# EAGLE design EMG_rev_I (EAGLE 7.6.0)
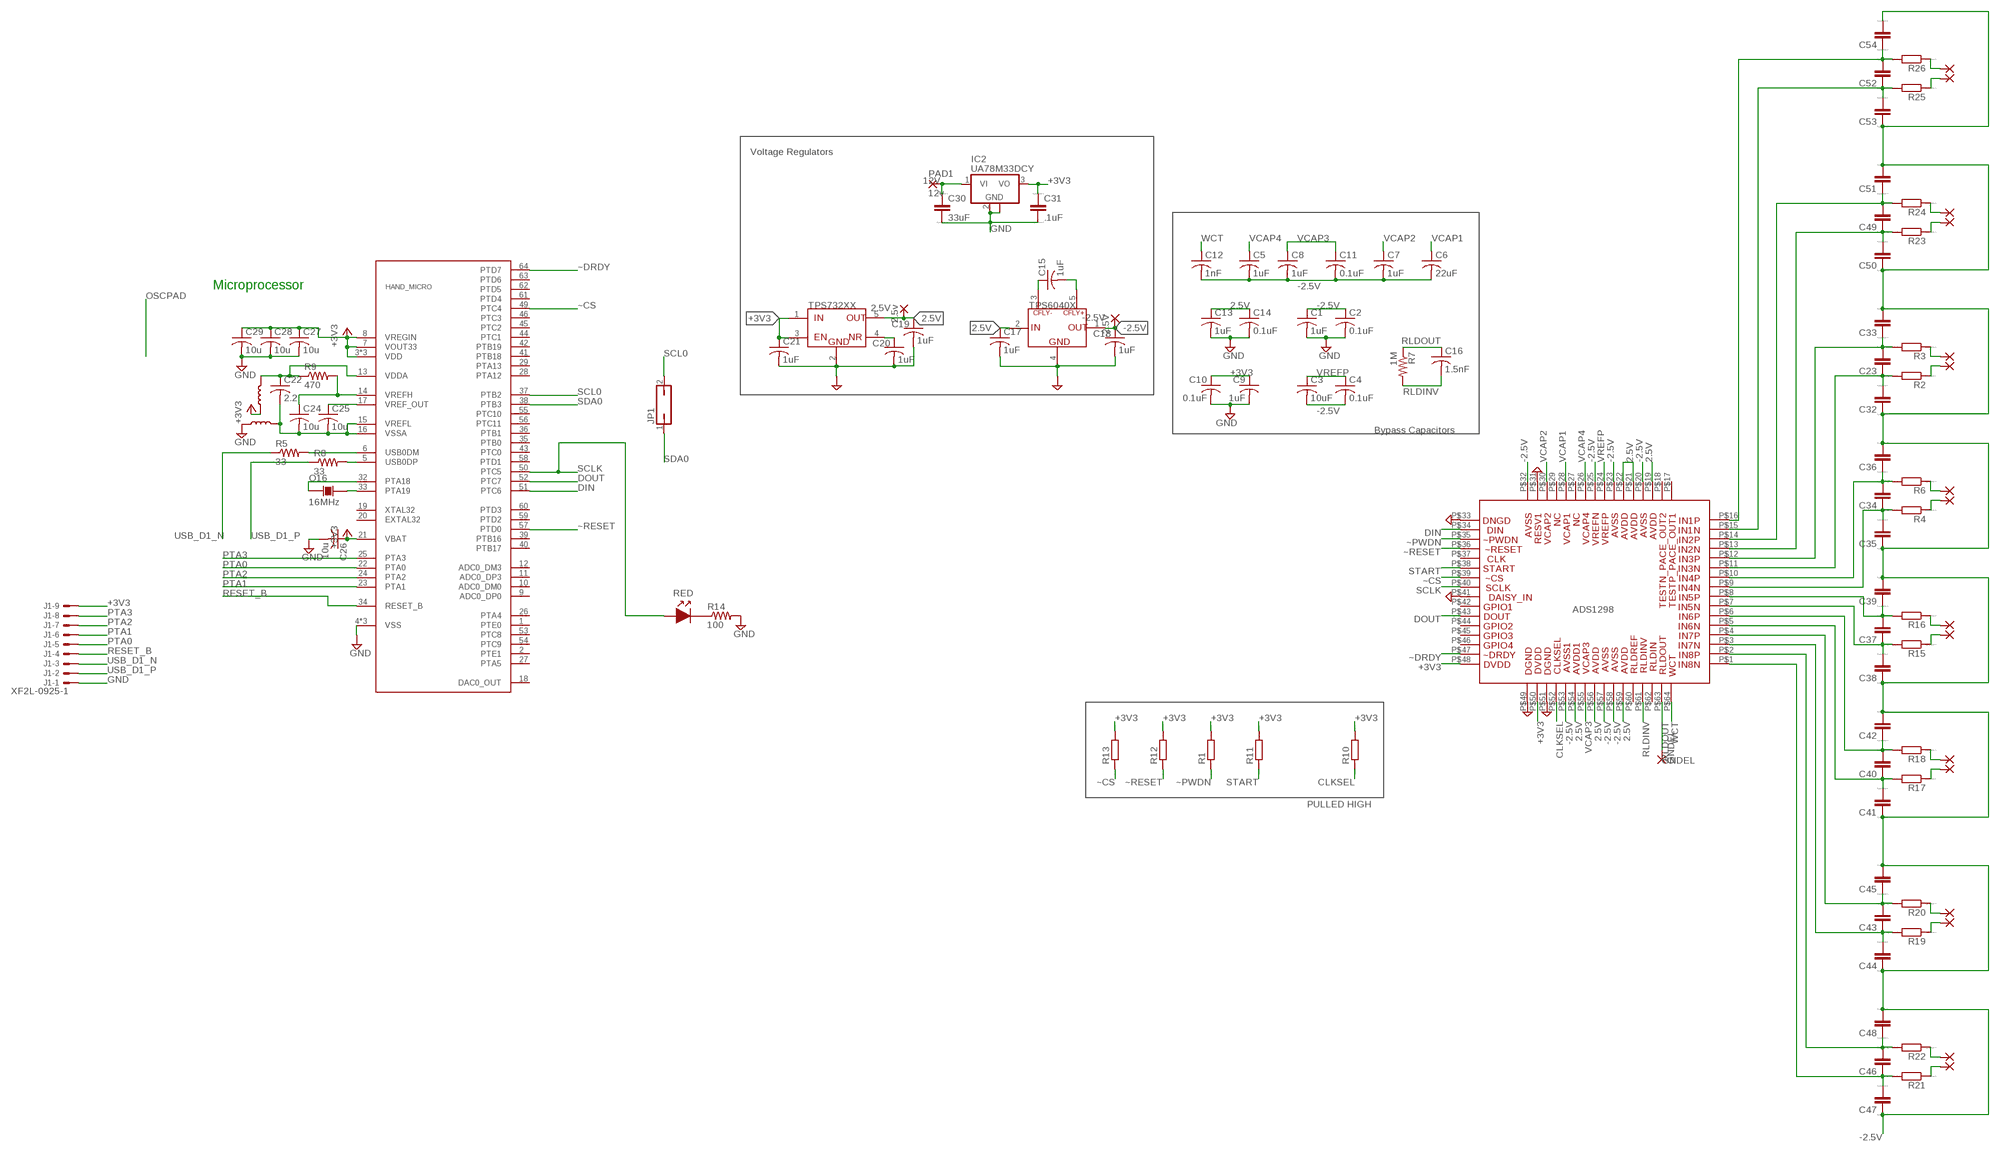
[diagram p0: schematic, sheet 1]

## Parts
2.5V  2.5v  2,54/0,9  [2,54/0,9]
-2.5V  -2.5V  2,54/0,9  [2,54/0,9]
C1  1uF  C-USC0603  [C0603]
C2  0.1uF  C-USC0603  [C0603]
C3  10uF  C-USC0603  [C0603]
C4  0.1uF  C-USC0603  [C0603]
C5  1uF  C-USC0603  [C0603]
C6  22uF  C-USC0603  [C0603]
C7  1uF  C-USC0603  [C0603]
C8  1uF  C-USC0603  [C0603]
C9  1uF  C-USC0603  [C0603]
C10  0.1uF  C-USC0603  [C0603]
C11  0.1uF  C-USC0603  [C0603]
C12  1nF  C-USC0603  [C0603]
C13  1uF  C-USC0603  [C0603]
C14  0.1uF  C-USC0603  [C0603]
C15  1uF  C-USC0603  [C0603]
C16  1.5nF  C-USC0603  [C0603]
C17  1uF  C-USC0603  [C0603]
C18  1uF  C-USC0603  [C0603]
C19  1uF  C-USC0603  [C0603]
C20  1uF  C-USC0603  [C0603]
C21  1uF  C-USC0603  [C0603]
C22  2.2  C-USC0402  [C0402]
C23  CC0402  [C0402]
C24  10u  C-USC0402  [C0402]
C25  10u  C-USC0402  [C0402]
C26  10u  C-USC0402  [C0402]
C27  10u  C-USC0402  [C0402]
C28  10u  C-USC0402  [C0402]
C29  10u  C-USC0402  [C0402]
C30  33uF  CC0402  [C0402]
C31  .1uF  CC0402  [C0402]
C32  CC0402  [C0402]
C33  CC0402  [C0402]
C34  CC0402  [C0402]
C35  CC0402  [C0402]
C36  CC0402  [C0402]
C37  CC0402  [C0402]
C38  CC0402  [C0402]
C39  CC0402  [C0402]
C40  CC0402  [C0402]
C41  CC0402  [C0402]
C42  CC0402  [C0402]
C43  CC0402  [C0402]
C44  CC0402  [C0402]
C45  CC0402  [C0402]
C46  CC0402  [C0402]
C47  CC0402  [C0402]
C48  CC0402  [C0402]
C49  CC0402  [C0402]
C50  CC0402  [C0402]
C51  CC0402  [C0402]
C52  CC0402  [C0402]
C53  CC0402  [C0402]
C54  CC0402  [C0402]
GNDEL  GNDEL  2,54/0,9  [2,54/0,9]
HAND_MICRO  MK20DX256VLH7  [LQFP-64-10-10]
IC2  UA78M33DCY  [SOT223]
J1  XF2L-0925-1  [XF2L-0925-1]
JP1  JP1Q  [JP1]
O16  16MHz  NX3225SA  [NX3225SA]
PAD1  12v  2,54/0,9  [2,54/0,9]
R1  RR0402  [R0402]
R2  RR0402  [R0402]
R3  RR0402  [R0402]
R4  RR0402  [R0402]
R5  33  R-US_R0402  [R0402]
R6  RR0402  [R0402]
R7  1M  R-US_R0603  [R0603]
R8  33  R-US_R0402  [R0402]
R9  470  R-US_R0402  [R0402]
R10  RR0402  [R0402]
R11  RR0402  [R0402]
R12  RR0402  [R0402]
R13  RR0402  [R0402]
R14  100  R-US_R0603  [R0603]
R15  RR0402  [R0402]
R16  RR0402  [R0402]
R17  RR0402  [R0402]
R18  RR0402  [R0402]
R19  RR0402  [R0402]
R20  RR0402  [R0402]
R21  RR0402  [R0402]
R22  RR0402  [R0402]
R23  RR0402  [R0402]
R24  RR0402  [R0402]
R25  RR0402  [R0402]
R26  RR0402  [R0402]
RED  LED0603  [L0603]
U$1  ADS1298  [TQFP-64]
U$2  FERRITE600OHM100MHZ  [L0603]
U$3  TPS6040X  [SOT23-5]
U$4  TPS732XX  [SOT23-5]
U$12  2X1,6/0,9  [2X1,6/0,9]
U$13  FERRITE600OHM100MHZ  [L0603]
U$14  2X1,6/0,9  [2X1,6/0,9]
U$15  2X1,6/0,9  [2X1,6/0,9]
U$16  2X1,6/0,9  [2X1,6/0,9]
U$17  2X1,6/0,9  [2X1,6/0,9]
U$18  2X1,6/0,9  [2X1,6/0,9]
U$19  2X1,6/0,9  [2X1,6/0,9]
U$20  2X1,6/0,9  [2X1,6/0,9]

## Nets
2.5V: 2.5V.1(P) C13.1 C14.1 C17.1 C19.1 U$1.P$19 U$1.P$21 U$1.P$22 U$1.P$54 U$1.P$56 U$1.P$59 U$3.2(IN) U$4.5(OUT)
12V: C30.1 IC2.1(VI) PAD1.1(P)
+3V3: C9.1 C10.1 C21.1 C26.1 C27.1 C28.1 C29.1 C31.1 HAND_MICRO.3(VDD) HAND_MICRO.7(VOUT33) HAND_MICRO.8(VREGIN) HAND_MICRO.21(VBAT) HAND_MICRO.30(VDD) HAND_MICRO.48(VDD) IC2.3(VO) J1.9 R1.2 R10.2 R11.2 R12.2 R13.2 U$1.P$48 U$1.P$50 U$4.1(IN) U$4.3(EN) U$13.1
-2.5V: -2.5V.1(P) C1.1 C2.1 C3.2 C4.2 C5.2 C6.2 C7.2 C8.2 C11.2 C12.2 C18.1 C32.1 C33.2 C35.1 C36.2 C38.1 C39.2 C41.1 C42.2 C44.1 C45.2 C47.1 C48.2 C50.1 C51.2 C53.1 C54.2 U$1.P$20 U$1.P$23 U$1.P$25 U$1.P$32 U$1.P$53 U$1.P$57 U$1.P$58 U$3.1(OUT)
CLKSEL: R10.1 U$1.P$52
DIN: HAND_MICRO.51(PTC6) U$1.P$34
DOUT: HAND_MICRO.52(PTC7) U$1.P$43
GND: C1.2 C2.2 C9.2 C10.2 C13.2 C14.2 C17.2 C18.2 C19.2 C20.2 C21.2 C26.2 C27.2 C28.2 C29.2 C30.2 C31.2 HAND_MICRO.4(VSS) HAND_MICRO.31(VSS) HAND_MICRO.47(VSS) IC2.2(GND) IC2.4(GND) J1.1 R14.2 U$1.P$31 U$1.P$33 U$1.P$41 U$1.P$49 U$1.P$51 U$2.1 U$3.4(GND) U$4.2(GND)
N$15: R3.1 U$12.2(P1)
N$16: R2.1 U$12.1(P)
N$17: C15.1 U$3.3(CFLY-)
N$18: C15.2 U$3.5(CFLY+)
N$20: C20.1 U$4.4(NR)
N$21: C22.2 C24.2 C25.2 HAND_MICRO.15(VREFL) HAND_MICRO.16(VSSA) U$2.2
N$22: C22.1 HAND_MICRO.13(VDDA) R9.1 U$13.2
N$23: C24.1 HAND_MICRO.14(VREFH) R9.2
N$24: HAND_MICRO.33(PTA19) O16.3
N$25: R14.1 RED.2
N$28: HAND_MICRO.32(PTA18) O16.1
N$30: C23.1 C32.2 R2.2 U$1.P$11
N$31: C23.2 C33.1 R3.2 U$1.P$12
N$32: R6.1 U$14.2(P1)
N$33: R4.1 U$14.1(P)
N$34: C25.1 HAND_MICRO.17(VREF_OUT)
N$35: C34.1 C35.2 R4.2 U$1.P$9
N$36: C34.2 C36.1 R6.2 U$1.P$10
N$37: R16.1 U$15.2(P1)
N$38: R15.1 U$15.1(P)
N$39: C37.1 C38.2 R15.2 U$1.P$7
N$40: C37.2 C39.1 R16.2 U$1.P$8
N$41: R18.1 U$16.2(P1)
N$42: R17.1 U$16.1(P)
N$43: C40.1 C41.2 R17.2 U$1.P$5
N$44: C40.2 C42.1 R18.2 U$1.P$6
N$45: R20.1 U$17.2(P1)
N$46: R19.1 U$17.1(P)
N$47: C43.1 C44.2 R19.2 U$1.P$3
N$48: C43.2 C45.1 R20.2 U$1.P$4
N$49: R22.1 U$18.2(P1)
N$50: R21.1 U$18.1(P)
N$51: C46.1 C47.2 R21.2 U$1.P$1
N$52: C46.2 C48.1 R22.2 U$1.P$2
N$53: R24.1 U$19.2(P1)
N$54: R23.1 U$19.1(P)
N$55: C49.1 C50.2 R23.2 U$1.P$13
N$56: C49.2 C51.1 R24.2 U$1.P$14
N$57: R26.1 U$20.2(P1)
N$58: R25.1 U$20.1(P)
N$59: C52.1 C53.2 R25.2 U$1.P$15
N$60: C52.2 C54.1 R26.2 U$1.P$16
PTA0: HAND_MICRO.22(PTA0) J1.5
PTA1: HAND_MICRO.23(PTA1) J1.6
PTA2: HAND_MICRO.24(PTA2) J1.7
PTA3: HAND_MICRO.25(PTA3) J1.8
RESET_B: HAND_MICRO.34(RESET_B) J1.4
RLDINV: C16.2 R7.2 U$1.P$61
RLDOUT: C16.1 GNDEL.1(P) R7.1 U$1.P$63
SCL0: HAND_MICRO.37(PTB2) JP1.2
SCLK: HAND_MICRO.50(PTC5) RED.1 U$1.P$40
SDA0: HAND_MICRO.38(PTB3) JP1.1
START: R11.1 U$1.P$38
USB_D1_N [USB]: J1.3 R5.1
USB_D1_P [USB]: J1.2 R8.1
USB_D2_N [USB]: HAND_MICRO.6(USB0DM) R5.2
USB_D2_P [USB]: HAND_MICRO.5(USB0DP) R8.2
VCAP1: C6.1 U$1.P$28
VCAP2: C7.1 U$1.P$30
VCAP3: C8.1 C11.1 U$1.P$55
VCAP4: C5.1 U$1.P$26
VREFP: C3.1 C4.1 U$1.P$24
WCT: C12.1 U$1.P$64
~CS: HAND_MICRO.49(PTC4) R13.1 U$1.P$39
~DRDY: HAND_MICRO.64(PTD7) U$1.P$47
~PWDN: R1.1 U$1.P$35
~RESET: HAND_MICRO.57(PTD0) R12.1 U$1.P$36
Unconnected: HAND_MICRO.1(PTE0) HAND_MICRO.2(PTE1) HAND_MICRO.9(ADC0_DP0) HAND_MICRO.10(ADC0_DM0) HAND_MICRO.11(ADC0_DP3) HAND_MICRO.12(ADC0_DM3) HAND_MICRO.18(DAC0_OUT) HAND_MICRO.19(XTAL32) HAND_MICRO.20(EXTAL32) HAND_MICRO.26(PTA4) HAND_MICRO.27(PTA5) HAND_MICRO.28(PTA12) HAND_MICRO.29(PTA13) HAND_MICRO.35(PTB0) HAND_MICRO.36(PTB1) HAND_MICRO.39(PTB16) HAND_MICRO.40(PTB17) HAND_MICRO.41(PTB18) HAND_MICRO.42(PTB19) HAND_MICRO.43(PTC0) HAND_MICRO.44(PTC1) HAND_MICRO.45(PTC2) HAND_MICRO.46(PTC3) HAND_MICRO.53(PTC8) HAND_MICRO.54(PTC9) HAND_MICRO.55(PTC10) HAND_MICRO.56(PTC11) HAND_MICRO.58(PTD1) HAND_MICRO.59(PTD2) HAND_MICRO.60(PTD3) HAND_MICRO.61(PTD4) HAND_MICRO.62(PTD5) HAND_MICRO.63(PTD6) U$1.P$17 U$1.P$18 U$1.P$27 U$1.P$29 U$1.P$37 U$1.P$42 U$1.P$44 U$1.P$45 U$1.P$46 U$1.P$60 U$1.P$62

## Notes on the sheet
- Voltage Regulators
- Microprocessor
- Bypass Capacitors
- PULLED HIGH

## Library data of the parts
2.5V -2.5V GNDEL PAD1 = wirepad:2,54/0,9: THROUGH-HOLE PAD
C1-C21 = adafruit:C-US: CAPACITOR, American symbol
C22 C24-C29 = rcl:C-US: CAPACITOR, American symbol
C23 C30-C54 = eagle-ltspice:C: CAPACITOR, European symbol; SPICEMODEL: NONE; SPICEPREFIX: C
HAND_MICRO = 445-eagle-lib:MK20DX256VLH7
IC2 = linear:UA78M*: POSITIVE-VOLTAGE REGULATORS Source: http://focus.ti.com/lit/ds/symlink/ua78m33.pdf
J1 = con-omron:XF2*-09?: OMRON FPC Connector Source : http://www.omron.com/ecb/products/pdf/fpc.pdf; MPN: XF2L-0925-1A; OC_FARNELL: unknown; OC_NEWARK: 05M1991
JP1 = jumper:JP1Q: JUMPER
O16 = 445-eagle-lib:NX3225SA
R1-R4 R6 R10-R13 R15-R26 = eagle-ltspice:R: RESISTOR, European symbol; SPICEMODEL: NONE; SPICEPREFIX: R
R5 R8 R9 R14 = rcl:R-US_: RESISTOR, American symbol
R7 = adafruit:R-US_: RESISTOR, American symbol
RED = 445-eagle-lib:LED0603
U$1 = ADS1298:ADS1298: ADS1298 Chris Yim - May 2015
U$2 U$13 = 445-eagle-lib:FERRITE600OHM100MHZ
U$3 = sot23-5:TPS6040X
U$4 = sot23-5:TPS732XX
U$12 U$14-U$20 = wirepad:2X1,6/0,9

## Net classes
1 USB: width 0.333 mm, drill 0.333 mm, clearance 0.178 mm

## Board
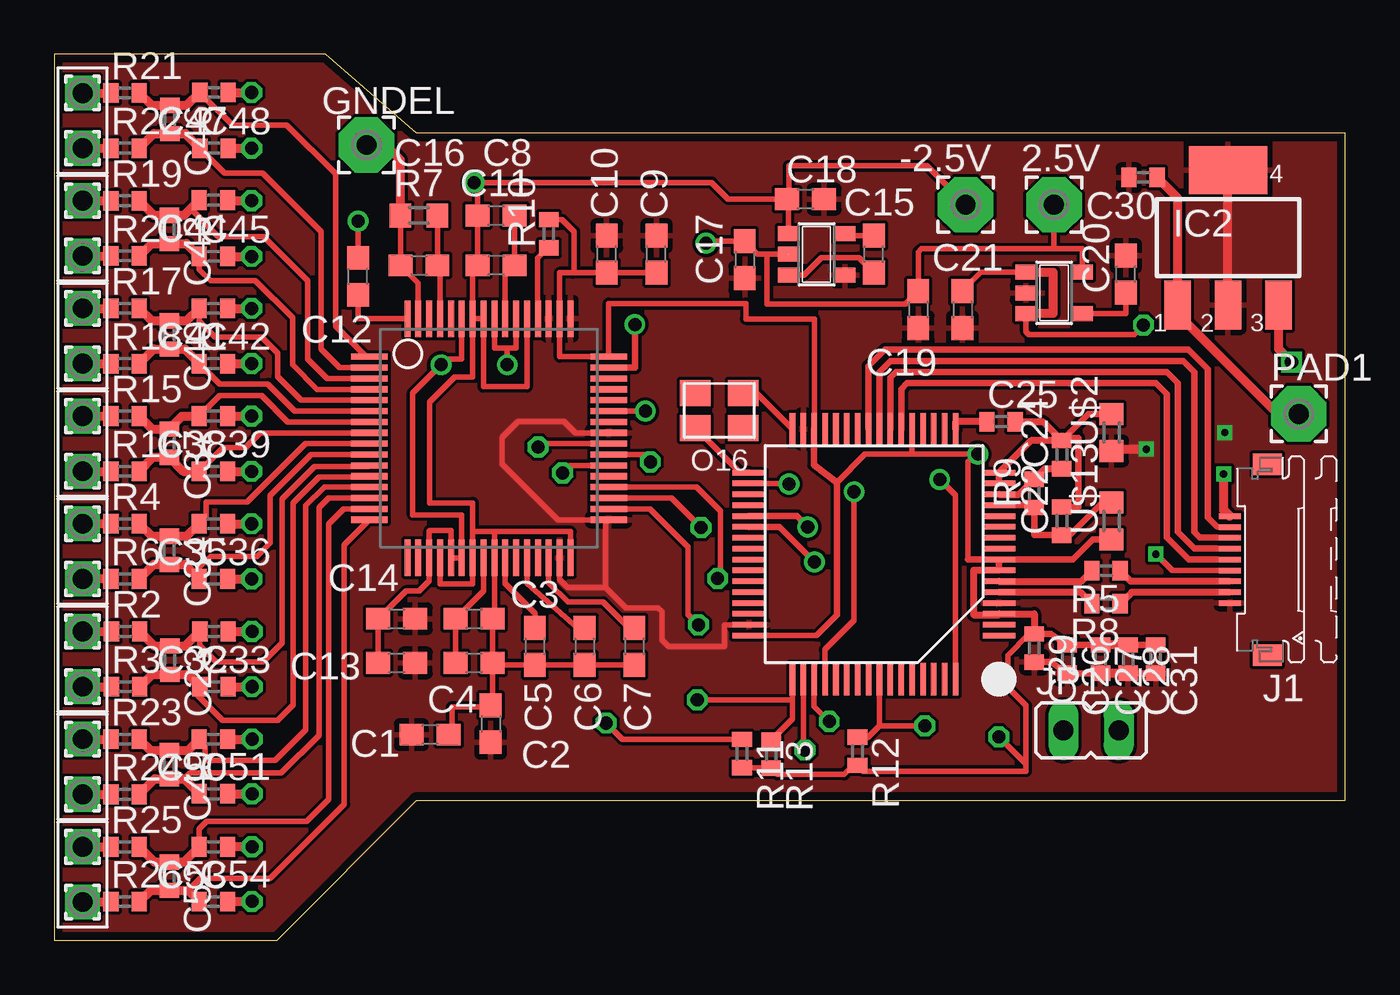
[diagram p1: board, top side]
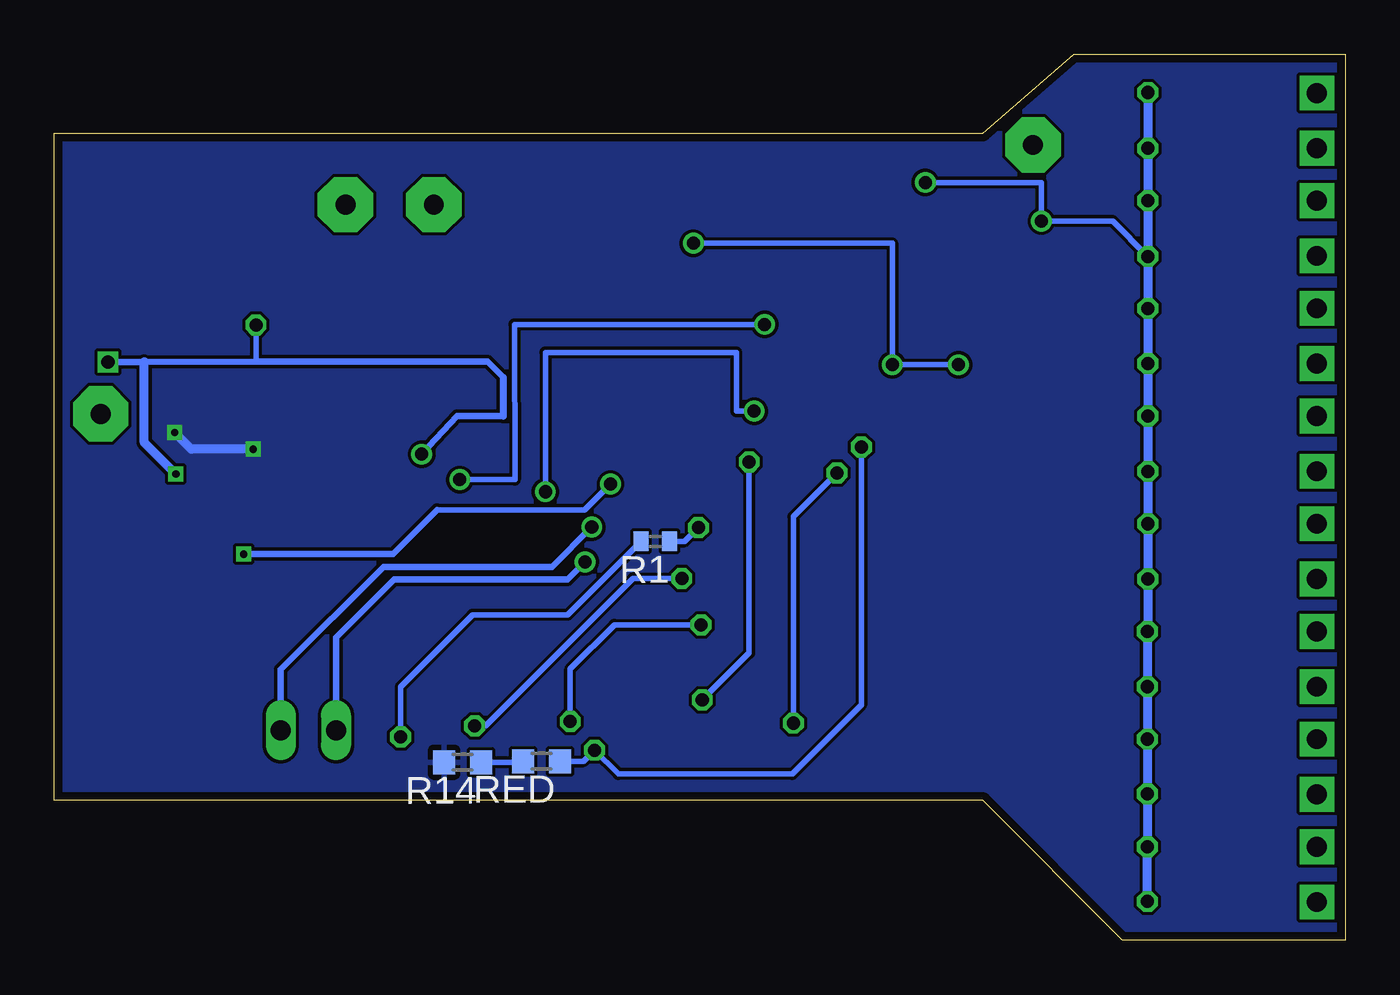
[diagram p2: board, bottom side, seen from below]

Size 59.36 x 40.74 mm. Coordinates in mm from the lower left corner, seen from the top.
Outline: 0,0 10.24,0 16.66,6.43 59.36,6.43 59.36,37.11 16.66,37.11 12.47,40.74 0,40.74 0,0
Copper layers (1*16): Top 0.0356mm / dielectric 1.5011mm / Bottom 0.0356mm
Design rules "LaenPCBOrder": minimum track width 6mil, minimum drill 13mil, track to track 6mil, track to pad 6mil, pad to pad 6mil, via to via 6mil, smd to smd 6mil, copper to edge 15mil, drill to drill 6mil, minimum pad ring 7mil, minimum via ring 7mil, stop-mask expansion 3mil, vias tented up to drill 0mil, thermal gap 10mil

### Footprints (pad centres in the part's own frame; a part is rotated, then mirrored left to right if it is on the bottom)
2,54/0,9 = drill 0.914 pad 2.54 octagon: 1 0,0
C0603 = smd 1.1 x 1: 1 -0.85,0; 2 0.85,0
C0402 = smd 0.7 x 0.9: 1 -0.65,0; 2 0.65,0
LQFP-64-10-10 = smd 1.5 x 0.254: 1 -5.75,3.75; 2 -5.75,3.25; 3 -5.75,2.75; 4 -5.75,2.25; 5 -5.75,1.75; 6 -5.75,1.25; 7 -5.75,0.75; 8 -5.75,0.25; 9 -5.75,-0.25; 10 -5.75,-0.75; 11 -5.75,-1.25; 12 -5.75,-1.75; 13 -5.75,-2.25; 14 -5.75,-2.75; 15 -5.75,-3.25; 16 -5.75,-3.75; 33 5.75,-3.75; 34 5.75,-3.25; 35 5.75,-2.75; 36 5.75,-2.25; 37 5.75,-1.75; 38 5.75,-1.25; 39 5.75,-0.75; 40 5.75,-0.25; 41 5.75,0.25; 42 5.75,0.75; 43 5.75,1.25; 44 5.75,1.75; 45 5.75,2.25; 46 5.75,2.75; 47 5.75,3.25; 48 5.75,3.75 | smd 0.254 x 1.5: 17 -3.75,-5.75; 18 -3.25,-5.75; 19 -2.75,-5.75; 20 -2.25,-5.75; 21 -1.75,-5.75; 22 -1.25,-5.75; 23 -0.75,-5.75; 24 -0.25,-5.75; 25 0.25,-5.75; 26 0.75,-5.75; 27 1.25,-5.75; 28 1.75,-5.75; 29 2.25,-5.75; 30 2.75,-5.75; 31 3.25,-5.75; 32 3.75,-5.75; 49 3.75,5.75; 50 3.25,5.75; 51 2.75,5.75; 52 2.25,5.75; 53 1.75,5.75; 54 1.25,5.75; 55 0.75,5.75; 56 0.25,5.75; 57 -0.25,5.75; 58 -0.75,5.75; 59 -1.25,5.75; 60 -1.75,5.75; 61 -2.25,5.75; 62 -2.75,5.75; 63 -3.25,5.75; 64 -3.75,5.75
SOT223 = smd 1.219 x 2.235: 1 -2.311,-3.099; 2 0,-3.099; 3 2.311,-3.099 | smd 3.6 x 2.2: 4 0,3.099
XF2L-0925-1 = smd 1 x 0.25: 1 1.905,2; 2 1.905,1.5; 3 1.905,1; 4 1.905,0.5; 5 1.905,0; 6 1.905,-0.5; 7 1.905,-1; 8 1.905,-1.5; 9 1.905,-2 | smd 1.34 x 1: M1 0.18,4.388; M2 0.18,-4.388
JP1 = drill 0.914 long: 1 0,-1.27; 2 0,1.27
NX3225SA = smd 1.4 x 1.2: 1 -1.1,-0.8; 2 1.1,-0.8; 3 1.1,0.8; 4 -1.1,0.8
R0402 = smd 0.7 x 0.9: 1 -0.65,0; 2 0.65,0
R0603 = smd 1 x 1.1: 1 -0.85,0; 2 0.85,0
L0603 = smd 1 x 1.1: 1 -0.85,0; 2 0.85,0
TQFP-64 = smd 1.676 x 0.279: P$1 -5.58,3.67; P$2 -5.58,3.17; P$3 -5.58,2.67; P$4 -5.58,2.17; P$5 -5.58,1.67; P$6 -5.58,1.17; P$7 -5.58,0.67; P$8 -5.58,0.17; P$9 -5.58,-0.33; P$10 -5.58,-0.83; P$11 -5.58,-1.33; P$12 -5.58,-1.83; P$13 -5.58,-2.33; P$14 -5.58,-2.83; P$15 -5.58,-3.33; P$16 -5.58,-3.83; P$33 5.42,-3.83; P$34 5.42,-3.33; P$35 5.42,-2.83; P$36 5.42,-2.33; P$37 5.42,-1.83; P$38 5.42,-1.33; P$39 5.42,-0.83; P$40 5.42,-0.33; P$41 5.42,0.17; P$42 5.42,0.67; P$43 5.42,1.17; P$44 5.42,1.67; P$45 5.42,2.17; P$46 5.42,2.67; P$47 5.42,3.17; P$48 5.42,3.67 | smd 0.279 x 1.676: P$17 -3.83,-5.58; P$18 -3.33,-5.58; P$19 -2.83,-5.58; P$20 -2.33,-5.58; P$21 -1.83,-5.58; P$22 -1.33,-5.58; P$23 -0.83,-5.58; P$24 -0.33,-5.58; P$25 0.17,-5.58; P$26 0.67,-5.58; P$27 1.17,-5.58; P$28 1.67,-5.58; P$29 2.17,-5.58; P$30 2.67,-5.58; P$31 3.17,-5.58; P$32 3.67,-5.58; P$49 3.67,5.42; P$50 3.17,5.42; P$51 2.67,5.42; P$52 2.17,5.42; P$53 1.67,5.42; P$54 1.17,5.42; P$55 0.67,5.42; P$56 0.17,5.42; P$57 -0.33,5.42; P$58 -0.83,5.42; P$59 -1.33,5.42; P$60 -1.83,5.42; P$61 -2.33,5.42; P$62 -2.83,5.42; P$63 -3.33,5.42; P$64 -3.83,5.42
SOT23-5 = smd 0.69 x 0.99: 1 -0.95,-1.29; 2 0,-1.29; 3 0.95,-1.29; 4 0.95,1.3; 5 -0.95,1.3
2X1,6/0,9 = drill 0.914 pad 1.6 square: 1 0,0; 2 0,-2.54

### Placement (x,y rotation side)
2.5V  45.97,33.83 0 top
-2.5V  41.91,33.83 0 top
C1  17.27,9.45 180 top
C2  20.07,9.96 270 top
C3  19.3,14.78 0 top
C4  19.3,12.75 0 top
C5  22.1,13.51 270 top
C6  24.38,13.51 270 top
C7  26.67,13.51 270 top
C8  20.32,31.04 180 top
C9  27.69,31.55 90 top
C10  25.4,31.55 90 top
C11  20.32,33.32 180 top
C12  13.97,30.53 90 top
C13  15.75,12.75 0 top
C14  15.75,14.78 0 top
C15  37.69,31.55 90 top
C16  16.76,31.04 0 top
C17  31.75,31.29 270 top
C18  34.54,34.09 0 top
C19  39.73,29.01 270 top
C20  49.28,30.63 90 top
C21  41.76,29.01 270 top
C22  46.33,19.28 90 top
C23  5.31,12.88 270 top
C24  46.33,22.33 90 top
C25  43.54,23.85 0 top
C26  46.58,12.93 270 top
C27  48.11,12.93 270 top
C28  49.38,12.93 270 top
C29  45.06,13.44 270 top
C30  50.06,35.08 180 top
C31  50.65,12.93 270 top
C32  7.34,14.2 180 top
C33  7.34,11.66 0 top
C34  5.28,17.93 270 top
C35  7.32,19.15 180 top
C36  7.32,16.61 0 top
C37  5.28,22.86 270 top
C38  7.32,24.1 180 top
C39  7.32,21.56 0 top
C40  5.28,27.84 270 top
C41  7.32,29.06 180 top
C42  7.32,26.52 0 top
C43  5.28,32.69 270 top
C44  7.32,34.04 180 top
C45  7.32,31.45 0 top
C46  5.31,37.74 270 top
C47  7.34,38.99 180 top
C48  7.34,36.42 0 top
C49  5.28,8.08 270 top
C50  7.32,9.25 180 top
C51  7.32,6.73 0 top
C52  5.28,2.95 270 top
C53  7.32,4.29 180 top
C54  7.32,1.78 0 top
GNDEL  14.35,36.58 0 top
HAND_MICRO  37.69,17.75 180 top
IC2  53.98,32.31 0 top
J1  55.96,17.5 180 top
JP1  47.68,9.65 270 top
O16  30.58,24.36 180 top
PAD1  57.23,24.21 0 top
R1  31.72,18.34 180 bottom
R2  3.28,14.2 0 top
R3  3.28,11.66 0 top
R4  3.25,19.15 0 top
R5  48.36,16.99 180 top
R6  3.25,16.61 0 top
R7  16.76,33.32 0 top
R8  48.36,15.47 180 top
R9  45.06,20.55 90 top
R10  22.73,32.49 90 top
R11  31.62,8.59 270 top
R12  36.93,8.69 270 top
R13  32.97,8.56 270 top
R14  40.59,8.18 180 bottom
R15  3.25,24.1 0 top
R16  3.25,21.56 0 top
R17  3.25,29.06 0 top
R18  3.25,26.52 0 top
R19  3.25,34.01 0 top
R20  3.25,31.47 0 top
R21  3.25,38.96 0 top
R22  3.25,36.42 0 top
R23  3.25,9.25 0 top
R24  3.25,6.71 0 top
R25  3.25,4.29 0 top
R26  3.25,1.78 0 top
RED  36.96,8.23 180 bottom
U$1  20.07,23.16 0 top
U$2  48.62,23.34 90 top
U$3  35.05,31.55 270 top
U$4  45.97,29.77 270 top
U$12  1.3,14.2 0 top
U$13  48.62,19.28 90 top
U$14  1.3,19.15 0 top
U$15  1.3,24.1 0 top
U$16  1.3,29.06 0 top
U$17  1.3,34.01 0 top
U$18  1.3,38.96 0 top
U$19  1.3,9.25 0 top
U$20  1.3,4.29 0 top

### Tracks (layer width: path | path; a pad name or v marks a point on that pad's centre or on a via)
2.5V  (via drill 0.6)
  Top 0.254: C13.1 C14.1 16.17,16.05 16.76,16.05 17.24,16.52 U$1.P$19 17.24,18.81 17.27,18.85 18.24,18.85 U$1.P$21 U$1.P$22 18.74,19.56 16.48,19.56 16.48,25.17 v17.78,26.47 18.03,26.72 18.74,26.72 U$1.P$59 | U$1.P$56 20.24,27.23 20.83,27.23 | U$1.P$54 21.24,27.23 20.83,27.23 | 20.83,27.23 v20.83,26.47 | 45.97,31.8 39.88,31.8 39.73,31.65 C19.1 39.13,29.26 32.77,29.26 32.77,31.55 U$3.2 32.35,31.55 C17.1 29.97,32.14 v29.97,32.05 | 45.97,31.8 47.27,31.8 U$4.5 | 2.5V.1 45.97,31.8
  Bottom 0.254: v17.78,26.47 v20.83,26.47 20.83,32.05 v29.97,32.05
12V
  Top 0.406: PAD1.1 56.26,24.21 51.66,28.8 IC2.1 51.66,34.13 C30.1
+3V3  (via drill 0.33, 0.6)
  Top 0.254: 23.85,30.7 C10.1 C9.1 | 23.85,30.7 23.24,30.7 U$1.P$50 23.24,26.84 U$1.P$48 25.49,29.29 31.8,29.29 31.8,28.57 34.95,28.57 HAND_MICRO.30 | 39.44,22.35 v42.47,22.35 42.01,22.02 42.01,17.5 | 39.44,22.35 HAND_MICRO.21 | C29.1 44.82,14.09 43.84,13.11 43.84,11.63 44.68,10.79 44.68,8.1 | 35.99,21.06 37.29,22.35 39.44,22.35 | 44.68,8.1 44.68,7.77 37.2,7.77 R12.2 36.74,8.04 36.32,7.62 33.26,7.62 R13.2 32.97,7.93 R11.2 | 35.99,14.96 35.04,14.01 HAND_MICRO.48 | R10.2 23.35,33.14 23.9,32.59 23.9,30.75 23.85,30.7 | v43.43,9.35 44.68,8.1 | C21.1 42.62,30.72 U$4.1 | v50.09,28.3 49.66,27.86 44.81,27.86 44.68,27.98 U$4.3
  Top 0.305: HAND_MICRO.30 34.94,21.86 35.99,21.06 35.99,14.96 | 42.01,17.5 HAND_MICRO.8 | HAND_MICRO.8 46.84,17.5 47.77,18.43 U$13.1 | HAND_MICRO.8 HAND_MICRO.7 | C27.1 C26.1 45.82,14.09 C29.1 | C31.1 C28.1
  Top 0.333: C29.1 45.06,15.01 HAND_MICRO.3 43.44,14.96 42.27,14.96 42.27,17.01 HAND_MICRO.7
  Top 0.406: C28.1 C27.1 | 44.68,30.79 U$4.1 45.92,30.72 45.92,28.83 U$4.3 | IC2.3 56.29,27.2 v56.9,26.59 | J1.9 53.77,19.78 v53.77,21.44
  Bottom 0.254: R1.2 35.75,14.96 40.13,14.96 43.43,11.66 v43.43,9.35 | 50.14,26.6 50.09,26.6 v50.09,28.3
  Bottom 0.305: v56.9,26.59 55.22,26.6 50.14,26.6 39.45,26.62 38.71,25.88 | 38.71,24.11 40.84,24.11 v42.47,22.35
  Bottom 0.333: 38.71,24.11 38.71,25.88
  Bottom 0.406: v53.77,21.44 55.22,22.89 55.22,26.6
-2.5V  (via drill 0.6)
  Top 0.254: U$1.P$20 17.75,16.39 19.24,16.39 U$1.P$23 19.24,18.8 | 20.25,18.8 U$1.P$25 20.24,14.78 C3.2 C4.2 | 20.25,18.8 19.24,18.8 | U$1.P$32 23.75,18.8 20.25,18.8 | C4.2 20.15,10.89 C2.1 20.07,10.72 18.29,10.72 18.29,9.45 C1.1 | C4.2 20.24,12.66 C5.2 C6.2 C7.2 | U$1.P$53 21.74,25.45 19.74,25.45 U$1.P$57 U$1.P$58 | U$1.P$58 19.24,30.8 C8.2 C11.2 19.47,34.85 v19.3,34.85 30.23,34.85 30.99,34.09 33.78,34.09 | C18.1 33.76,34.02 U$3.1 33.76,34.07 33.78,34.09 | v13.97,33.07 C12.2 | 33.78,34.09 33.78,35.61 40.13,35.61 -2.5V.1 | U$1.P$58 19.24,25.91 18.41,25.91 17.25,24.74 17.25,20.12 19.24,20.12 19.24,18.8
  Top 0.406: C54.2 v9.09,1.78 | v9.09,4.29 C53.1 | C51.2 v9.09,6.73 | C50.1 v9.09,9.25 | C33.2 v9.09,11.66 | C32.1 v9.09,14.2 | C36.2 v9.07,16.61 | C35.1 v9.07,19.15 | C39.2 v9.07,21.57 | C38.1 v9.07,24.11 | C42.2 v9.07,26.52 | C41.1 v9.07,29.06 | C45.2 v9.07,31.45 | C44.1 7.99,34.01 v9.07,34.01 | C48.2 v9.07,36.42 | C47.1 v9.07,38.99
  Bottom 0.254: v19.3,34.85 13.97,34.85 v13.97,33.07 10.69,33.07 v9.07,31.45
  Bottom 0.406: v9.09,1.78 v9.09,4.29 v9.09,6.73 v9.09,9.25 v9.09,11.66 v9.09,14.2 9.07,14.22 v9.07,16.61 v9.07,19.15 v9.07,21.57 v9.07,24.11 v9.07,26.52 v9.07,29.06 v9.07,31.45 v9.07,34.01 v9.07,36.42 v9.07,38.99
CLKSEL
  Top 0.254: R10.1 22.69,31.84 22.23,31.37 22.23,28.6 U$1.P$52
DIN  (via drill 0.6)
  Top 0.254: HAND_MICRO.51 34.94,10.75 v35.64,10.06 | v29.62,14.5 29.13,14.99 29.13,18.09 27.38,19.84 U$1.P$34
  Bottom 0.254: v35.64,10.06 35.64,12.47 33.6,14.5 v29.62,14.5
DOUT  (via drill 0.6)
  Top 0.254: U$1.P$43 v27.18,24.34 v27.18,24.33 | v36.78,20.62 36.78,14.71 35.43,13.36 35.43,12.02 HAND_MICRO.52
  Bottom 0.254: v27.18,24.33 27.99,24.33 27.99,27.03 36.78,27.03 v36.78,20.62
GND  (via drill 0.33)
  Top 0.254: U$1.P$31 23.24,16.59 23.6,16.23 25.35,16.23 | 25.35,16.23 25.35,19.2 U$1.P$33 23.16,19.34 20.6,21.89 20.6,23.11 21.34,23.85 23.44,23.85 23.96,23.34 U$1.P$41 | HAND_MICRO.47 30.81,14.51 30.81,13.51 28.25,13.51 27.94,13.82 27.94,15.11 27.76,15.29 26.29,15.29 25.35,16.23
  Top 0.305: C29.2 45.82,12.79 C26.2 C27.2 48.25,12.42 | 49.49,12.17 C28.2 C31.2
  Top 0.406: IC2.2 IC2.4 | U$2.1 48.7,22.58 v50.22,22.58 | C28.2 C27.2
  Bottom 0.406: v50.22,22.58 53.06,22.58 v53.82,23.34
  pour Bottom: 0,0 10.24,0 16.66,6.43 59.36,6.43 59.36,37.11 16.66,37.11 12.47,40.77 0,40.77
  pour Top: 0,0 10.24,0 16.66,6.43 59.36,6.43 59.36,37.11 16.66,37.11 12.47,40.77 -0.03,40.77
N$15
  Top 0.406: U$12.2 R3.1
N$16
  Top 0.406: U$12.1 R2.1
N$17
  Top 0.254: U$3.3 34.48,30.6 35.28,31.39 37,31.39 C15.1
N$18
  Top 0.254: C15.2 36.45,32.4 U$3.5
N$20
  Top 0.254: U$4.4 49.28,28.82 C20.1
N$21
  Top 0.305: C22.2 47.09,19.93 47.09,23.09 46.33,23.09 C24.2 47.55,24.19 U$2.2 | HAND_MICRO.15 HAND_MICRO.16
  Top 0.333: HAND_MICRO.16 44.92,22.98 C24.2 45.46,23.85 C25.2
N$22
  Top 0.305: HAND_MICRO.13 45.06,20 R9.1 45.06,18.63 C22.1 46.7,18.63 48.11,20.04 48.53,20.04 U$13.2
N$23
  Top 0.333: C24.1 45.54,21.68 R9.2 44.37,20.5 HAND_MICRO.14
N$24
  Top 0.305: HAND_MICRO.33 31.54,21.5 O16.3
N$25
  Bottom 0.254: RED.2 37.86,8.18 R14.1
N$28
  Top 0.305: O16.1 32.29,25.16 HAND_MICRO.32
N$30
  Top 0.254: C32.2 6.69,13.55 7.44,12.8 9.6,12.8 10.46,13.66 10.46,20.3 11.96,21.79 14.44,21.79 U$1.P$11
  Top 0.406: R2.2 4.6,13.53 C23.1 6.02,13.53 C32.2
N$31
  Top 0.254: U$1.P$12 14.46,21.31 12.17,21.31 10.97,20.12 10.97,10.82 10.26,10.11 7.75,10.11 6.45,11.4 6.45,11.9
  Top 0.406: R3.2 4.5,12.23 C23.2 6.12,12.23 6.45,11.9 C33.1
N$32
  Top 0.406: R6.1 U$14.2
N$33
  Top 0.406: R4.1 U$14.1
N$34
  Top 0.333: C25.1 41.44,23.85 HAND_MICRO.17
N$35
  Top 0.254: C35.2 6.99,19.47 6.99,20.14 8.87,20.14 11.56,22.84 U$1.P$9
  Top 0.406: C35.2 6.1,18.58 C34.1 4.47,18.58 R4.2
N$36
  Top 0.254: C36.1 6.67,17.13 7.19,17.65 9.32,17.65 9.93,18.26 9.93,20.45 11.82,22.34 U$1.P$10
  Top 0.406: C36.1 5.99,17.28 C34.2 4.57,17.28 R6.2
N$37
  Top 0.406: U$15.2 R16.1
N$38
  Top 0.406: U$15.1 R15.1
N$39
  Top 0.254: C38.2 7.61,25.04 9.53,25.04 10.73,23.84 U$1.P$7
  Top 0.406: R15.2 4.5,23.51 C37.1 5.88,24.11 C38.2
N$40
  Top 0.254: C39.1 7.76,22.66 8.79,22.66 9.47,23.34 U$1.P$8
  Top 0.406: R16.2 4.55,22.21 C37.2 5.93,21.57 C39.1
N$41
  Top 0.406: U$16.2 R18.1
N$42
  Top 0.406: U$16.1 R17.1
N$43
  Top 0.254: C41.2 6.67,28.46 7.39,27.74 9.53,27.74 10.26,27 10.26,25.93 11.36,24.84 U$1.P$5
  Top 0.406: R17.2 4.47,28.49 C40.1 6.1,28.49 C41.2
N$44
  Top 0.254: C42.1 7.61,25.58 9.8,25.58 11.05,24.34 U$1.P$6
  Top 0.406: R18.2 4.57,27.19 C40.2 5.99,27.19 C42.1
N$45
  Top 0.406: U$17.2 R20.1
N$46
  Top 0.406: U$17.1 R19.1
N$47
  Top 0.254: U$1.P$3 12.54,25.84 11.66,26.72 11.66,30.33 9.63,32.36 7.54,32.36 6.27,33.64
  Top 0.406: R19.2 4.57,33.34 C43.1 5.97,33.34 6.27,33.64 C44.2
N$48
  Top 0.254: C45.1 6.67,30.85 7.19,30.33 9.25,30.33 10.95,28.63 10.95,26.47 12.08,25.34 U$1.P$4
  Top 0.406: R20.2 4.47,32.04 C43.2 6.07,32.04 C45.1
N$49
  Top 0.406: U$18.2 R22.1
N$50
  Top 0.406: U$18.1 R21.1
N$51
  Top 0.254: U$1.P$1 14.34,26.84 12.93,28.25 12.93,35.26 10.69,37.49 8.19,37.49 C47.2
  Top 0.406: C47.2 6.1,38.39 C46.1 4.47,38.39 R21.2
N$52
  Top 0.254: U$1.P$2 13.11,26.34 12.27,27.18 12.27,32.59 9.58,35.28 7.83,35.28 C48.1
  Top 0.406: C48.1 6.02,37.09 C46.2 4.57,37.09 R22.2
N$53
  Top 0.406: U$19.2 R24.1
N$54
  Top 0.406: U$19.1 R23.1
N$55
  Top 0.254: C50.2 6.93,8.98 6.93,8.28 10.16,8.28 11.56,9.68 11.56,19.99 12.42,20.85 12.44,20.84 U$1.P$13
  Top 0.406: C50.2 6.15,8.73 C49.1 4.42,8.73 R23.2
N$56
  Top 0.254: 5.97,7.43 6.24,7.7 10.44,7.7 12.17,9.42 12.17,19.89 12.61,20.34 U$1.P$14
  Top 0.406: C51.1 5.97,7.43 C49.2 4.62,7.43 R24.2
N$57
  Top 0.406: U$20.2 2.6,1.75 R26.1
N$58
  Top 0.406: U$20.1 R25.1
N$59
  Top 0.254: C53.2 6.67,5.12 7.01,5.46 11.61,5.46 12.62,6.48 12.62,19.15 13.31,19.84 U$1.P$15
  Top 0.406: R25.2 4.6,3.6 C52.1 5.97,3.6 C53.2
N$60
  Top 0.254: 6.15,2.3 6.7,2.85 9.93,2.85 13.34,6.25 13.34,18.18 U$1.P$16
  Top 0.406: R26.2 4.42,2.3 C52.2 6.15,2.3 C54.1
OSCPAD
  pour Bottom: 32.87,21.31 29.82,21.31 28.55,22.58 28.55,26.14 28.8,26.39 32.36,26.39 34.14,24.61 34.14,22.58
PTA0
  Top 0.254: J1.5 53.48,17.5
  Top 0.305: HAND_MICRO.22 38.94,25.36 39.22,25.63 50.65,25.63 51.16,25.12 51.16,18.52 52.17,17.5 53.48,17.5
PTA1
  Top 0.254: J1.6 53.48,18 53.47,18.01
  Top 0.305: HAND_MICRO.23 38.44,25.87 38.71,26.14 51.16,26.14 51.66,25.63 51.66,18.77 52.43,18.01 53.47,18.01
PTA2
  Top 0.254: J1.7 53.48,18.5 53.46,18.52
  Top 0.305: HAND_MICRO.24 37.94,26.13 38.46,26.64 51.92,26.64 52.43,26.14 52.43,18.77 52.68,18.52 53.46,18.52
PTA3
  Top 0.254: J1.8 53.48,19 53.03,19.44
  Top 0.305: HAND_MICRO.25 37.44,26.39 38.2,27.15 52.15,27.15 53.03,26.26 53.03,19.44
RESET_B  (via drill 0.33, 0.6)
  Top 0.254: HAND_MICRO.34 33.76,21 v33.78,20.98 | J1.4 51.41,17 v50.65,17.75
  Bottom 0.254: v33.78,20.98 34.98,19.79 41.76,19.79
  Bottom 0.305: v50.65,17.75 43.79,17.75 41.76,19.79
RLDINV
  Top 0.254: U$1.P$61 17.74,30.92 C16.2 R7.2
RLDOUT
  Top 0.254: U$1.P$63 16.74,30.22 C16.1 R7.1
  Top 0.406: GNDEL.1 15.21,36.58 15.9,35.89 15.9,33.34 R7.1
SCL0  (via drill 0.6)
  Top 0.305: HAND_MICRO.37 34.14,19.5 v34.65,19
  Bottom 0.305: v34.65,19 36.47,17.17 44.22,17.17 48.95,12.45 JP1.2
SCLK  (via drill 0.6)
  Top 0.254: HAND_MICRO.50 34.44,8.81 v34.52,8.74 | U$1.P$40 22.4,22.84 v22.25,22.68
  Bottom 0.254: RED.1 35.03,8.23 v34.52,8.74 33.43,7.64 25.43,7.64 22.25,10.82 v22.25,22.68
SDA0  (via drill 0.6)
  Top 0.305: v34.95,17.4 33.34,19 HAND_MICRO.38
  Bottom 0.305: JP1.1 46.41,13.92 43.74,16.59 35.76,16.59 v34.95,17.4
START  (via drill 0.6)
  Top 0.254: U$1.P$38 23.71,21.84 v23.37,21.49 | v25.38,9.98 26.12,9.23 R11.1
  Bottom 0.254: v23.37,21.49 25.38,19.48 v25.38,9.98
USB_D1_N
  Top 0.333: J1.3 49.5,16.5 R5.1
USB_D1_P
  Top 0.333: J1.2 49.54,16 R8.1
USB_D2_N
  Top 0.333: R5.2 47.22,16.5 HAND_MICRO.6
USB_D2_P
  Top 0.333: R8.2 47.18,16 HAND_MICRO.5
VCAP1
  Top 0.254: U$1.P$28 21.74,16.41 23.88,14.53 24.22,14.53 C6.1
VCAP2
  Top 0.254: U$1.P$30 22.74,16.43 23.62,15.54 25.23,15.54 26.42,14.36 C7.1
VCAP3
  Top 0.254: U$1.P$55 20.74,30.61 C8.1 C11.1
VCAP4
  Top 0.254: U$1.P$26 20.74,16.4 22.1,15.04 C5.1
VREFP
  Top 0.254: U$1.P$24 19.74,16.07 C3.1 C4.1
WCT
  Top 0.254: U$1.P$64 13.97,28.59 C12.1
~CS  (via drill 0.6)
  Top 0.254: HAND_MICRO.49 33.94,11.02 | 33.94,11.02 33.94,10.18 R13.1 | U$1.P$39 27.07,22.34 v27.41,22 | v29.57,11.05 33.92,11.05 33.94,11.02
  Bottom 0.254: v27.41,22 27.41,13.21 v29.57,11.05
~DRDY  (via drill 0.6)
  Top 0.254: v40.72,21.18 41.44,20.48 HAND_MICRO.64
  Top 0.305: U$1.P$47 26.7,26.34 v26.7,28.32
  Bottom 0.254: v26.7,28.32 38.2,28.32 38.18,21.18 v40.72,21.18
~PWDN  (via drill 0.6)
  Top 0.254: v29.74,18.97 28.38,20.34 U$1.P$35
  Bottom 0.254: R1.1 30.38,18.34 v29.74,18.97
~RESET  (via drill 0.6)
  Top 0.254: HAND_MICRO.57 37.94,9.86 | 37.94,9.86 v40.03,9.86 | R12.1 37.42,9.34 37.94,9.86 | U$1.P$36 29.53,20.84 30.63,19.74 30.63,16.76 v30.5,16.64
  Bottom 0.254: v40.03,9.86 39.52,9.86 32.74,16.64 v30.5,16.64